# Altium schematic sheet [4]-RF.SchDoc
size A4
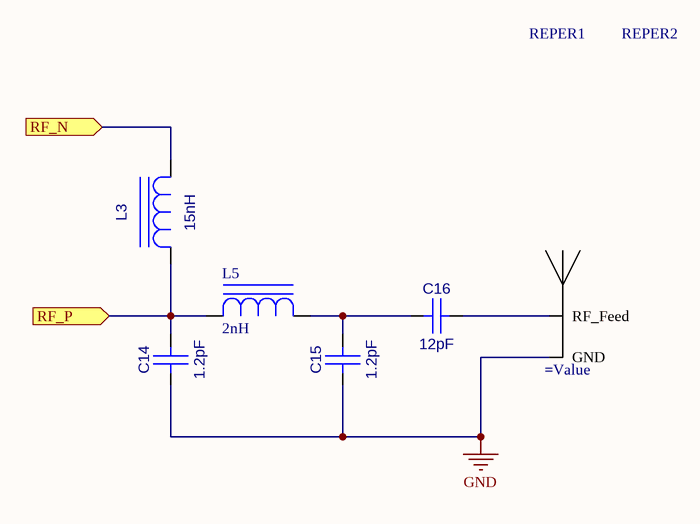
[diagram p0: [4]-RF.SchDoc]

## Parts
=Value  ANTENNA_IFA_245_1MM  [IFA245_1mm]  (value not drawn)
C14  1.2pF  [CC0603]
C15  1.2pF  [CC0603]
C16  12pF  [CC0603]
L3  value 15nH  [L0603]  (hidden comment: L0603)
L5  2nH  [L0402]
REPER1  REPER1.2  [REPER1.2]  (value not drawn)
REPER2  REPER1.2  [REPER1.2]  (value not drawn)

## Ports
RF_N (in), RF_P (in)

## Nets
GND: =Value.2(GND) C14.1(A) C15.1(A)
RF_N: L3.2(C) ; port RF_N
RF_P: C14.2(B) L3.1(A) L5.1(A) ; port RF_P
Net=Value_1: =Value.1(RF_Feed) C16.2(B)
NetC15_2: C15.2(B) C16.1(A) L5.2(C)

Not connected (* = marked no-connect by the designer): REPER1 1; REPER2 1

## Library data of the parts
=Value = ANTENNA_IFA_245_1MM: Antenna 2.45GHz; Value: IFA 2.45GHz
C14-C16 = CC0603
  C14 C15: Value: 1.2pF
  C16: Value: 12pF
L5 = L0402: Value: 2nH
REPER1 REPER2 = REPER1.2: Value: *